# EAGLE design lcd_buckler_mk_1 (EAGLE 6.5.0)
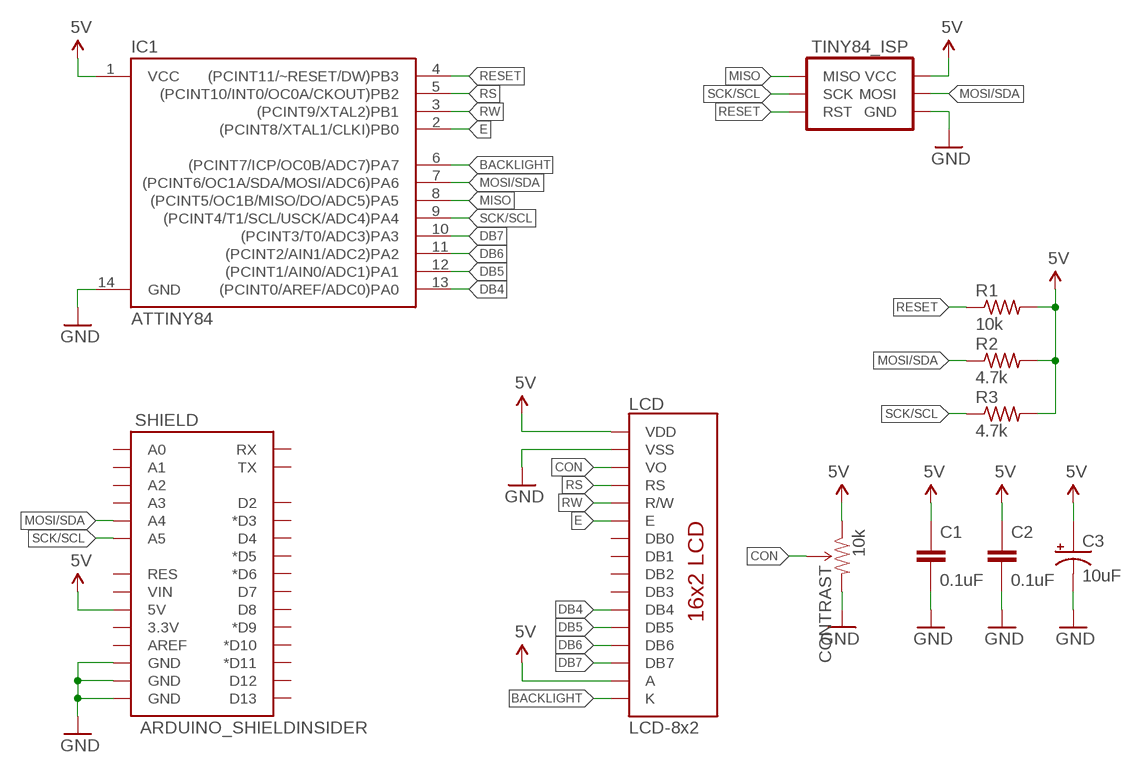
[diagram p0: schematic, sheet 1]

## Parts
C1  0.1uF  CAPACITOR-CERAMIC025-024X044  [C025-024X044]
C2  0.1uF  CAPACITOR-CERAMIC025-024X044  [C025-024X044]
C3  10uF  CAPACITOR-POLARIZEDE2.5-5  [E2,5-5]
CONTRAST  10k  TRIMPOTPTH  [TRIM_POT_PTH]
IC1  ATTINY84  ATTINY84ATTINY84-20PU  [DIL14]
LCD  LCD-8x2  LCD-16X28X2  [LCD-8X2]
R1  10k  RESISTORPTH-AXIAL-7.68MM  [RESISTOR-AXIAL-PTH-7.68MM]
R2  4.7k  RESISTORPTH-AXIAL-7.68MM  [RESISTOR-AXIAL-PTH-7.68MM]
R3  4.7k  RESISTORPTH-AXIAL-7.68MM  [RESISTOR-AXIAL-PTH-7.68MM]
SHIELD  ARDUINO_SHIELDINSIDER  [ARDUINO_SHIELD_NOOUTLINE_INSIDE]
TINY84_ISP  AVR_SPI_PRG_6PTH  [2X3]

## Nets
5V: C1.1 C2.1 C3.+ CONTRAST.1(CCW) IC1.1(VCC) LCD.2(VDD) LCD.15(A) R1.P$2 R2.P$2 R3.P$2 SHIELD.5V TINY84_ISP.2(VCC)
BACKLIGHT: IC1.6((PCINT7/ICP/OC0B/ADC7)PA7) LCD.16(K)
CON: CONTRAST.2(WIPER) LCD.3(VO)
DB4: IC1.13((PCINT0/AREF/ADC0)PA0) LCD.11(DB4)
DB5: IC1.12((PCINT1/AIN0/ADC1)PA1) LCD.12(DB5)
DB6: IC1.11((PCINT2/AIN1/ADC2)PA2) LCD.13(DB6)
DB7: IC1.10((PCINT3/T0/ADC3)PA3) LCD.14(DB7)
E: IC1.2((PCINT8/XTAL1/CLKI)PB0) LCD.6(E)
GND: C1.2 C2.2 C3.- CONTRAST.3(CW) IC1.14(GND) LCD.1(VSS) SHIELD.GND@0(GND) SHIELD.GND@1(GND) SHIELD.GND@2(GND) TINY84_ISP.6(GND)
MISO: IC1.8((PCINT5/OC1B/MISO/DO/ADC5)PA5) TINY84_ISP.1(MISO)
MOSI/SDA: IC1.7((PCINT6/OC1A/SDA/MOSI/ADC6)PA6) R2.P$1 SHIELD.A4 TINY84_ISP.4(MOSI)
RESET: IC1.4((PCINT11/~RESET/DW)PB3) R1.P$1 TINY84_ISP.5(RST)
RS: IC1.5((PCINT10/INT0/OC0A/CKOUT)PB2) LCD.4(RS)
RW: IC1.3((PCINT9/XTAL2)PB1) LCD.5(R/W)
SCK/SCL: IC1.9((PCINT4/T1/SCL/USCK/ADC4)PA4) R3.P$1 SHIELD.A5 TINY84_ISP.3(SCK)
Unconnected: LCD.7(DB0) LCD.8(DB1) LCD.9(DB2) LCD.10(DB3) SHIELD.3.3V SHIELD.A0 SHIELD.A1 SHIELD.A2 SHIELD.A3 SHIELD.AREF SHIELD.D2 SHIELD.D3(*D3) SHIELD.D4 SHIELD.D5(*D5) SHIELD.D6(*D6) SHIELD.D7 SHIELD.D8 SHIELD.D9(*D9) SHIELD.D10(*D10) SHIELD.D11(*D11) SHIELD.D12 SHIELD.D13 SHIELD.RES SHIELD.RX SHIELD.TX SHIELD.VIN

## Library data of the parts
C1 C2 = A_butts:CAPACITOR-CERAMIC: CAPACITOR, European symbol
C3 = A_butts:CAPACITOR-POLARIZED: POLARIZED CAPACITOR, American symbol
CONTRAST = A_butts:TRIMPOT: Various small potentiometers for "set-and-forget" applications
IC1 = A_butts:ATTINY84: Atmel 14-pin 2/4/8kB flash uC
LCD = A_butts:LCD-16X2: Standard text-only 16x2 parallel input LCD
R1-R3 = A_butts:RESISTOR: RESISTOR, American symbol
SHIELD = A_butts:ARDUINO_SHIELD: Arduino shield footprint
TINY84_ISP = A_butts:AVR_SPI_PRG_6: AVR ISP 6 Pin This is the reduced ISP connector for AVR programming. Common on Arduino. This footprint will take up less PCB space and can be used with a 10-pin to 6-pin adapter such as SKU: BOB-08508 **Special note about "TEST_POINT" package. The stop mask is on the top side, so if you want your programming test points to be on the bottom of your board, make sure to place this package on the bottom side of the board. This also ensure that the orientation to program from the bottom side will be correct.

## Board
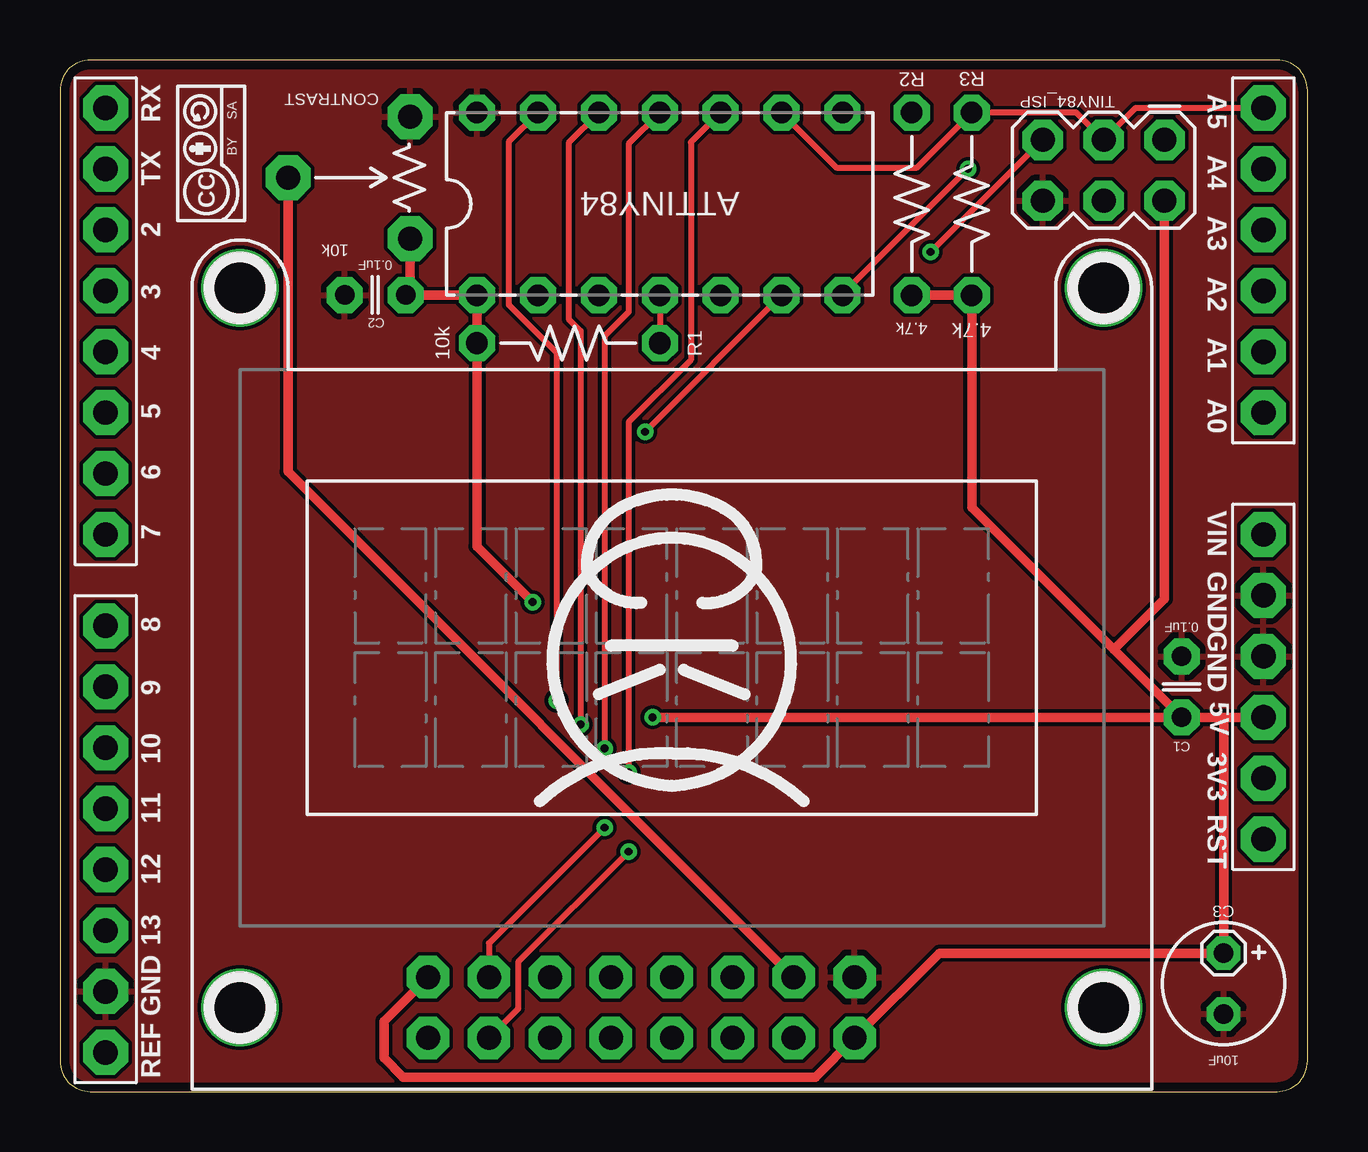
[diagram p1: board, top side]
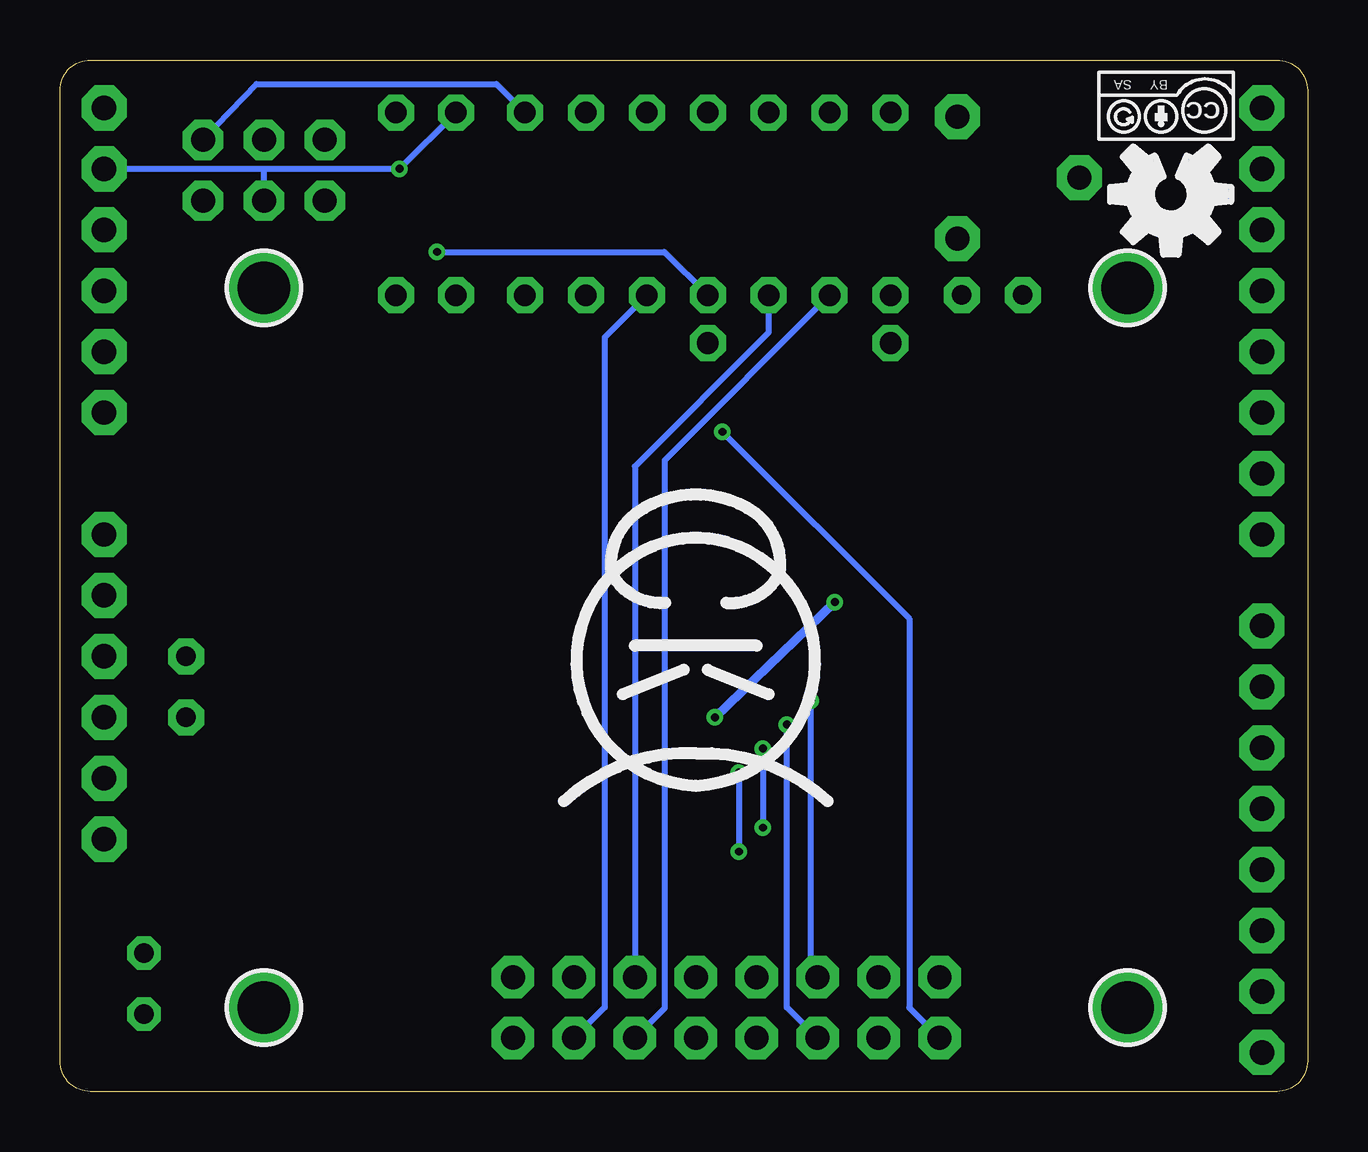
[diagram p2: board, bottom side, seen from below]

Size 52 x 43 mm. Coordinates in mm from the lower left corner, seen from the top.
Outline: 0,41.73 0,1.27 arc90 1.27,0 50.73,0 arc90 52,1.27 52,41.73 arc90 50.73,43 1.27,43 arc90 0,41.73
Copper layers (1*16): Top 0.0356mm / dielectric 1.5011mm / Bottom 0.0356mm
Design rules "LaenPCBOrder_2": minimum track width 6mil, minimum drill 13mil, track to track 6mil, track to pad 6mil, pad to pad 6mil, via to via 6mil, smd to smd 6mil, copper to edge 15mil, drill to drill 6mil, minimum pad ring 7mil, minimum via ring 7mil, stop-mask expansion 3mil, vias tented up to drill 20mil, thermal gap 10mil

### Footprints (pad centres in the part's own frame; a part is rotated, then mirrored left to right if it is on the bottom)
C025-024X044 = drill 0.813 pad 1.5 octagon: 1 -1.27,0; 2 1.27,0
E2,5-5 = drill 0.8 pad 1.4 octagon: + -1.27,0; - 1.27,0
TRIM_POT_PTH = drill 1 pad 1.88 octagon: 1 -2.54,-2.54; 2 0,2.54; 3 2.54,-2.54
DIL14 = drill 0.9 pad 1.5 octagon: 1 -7.62,-3.81; 2 -5.08,-3.81; 3 -2.54,-3.81; 4 0,-3.81; 5 2.54,-3.81; 6 5.08,-3.81; 7 7.62,-3.81; 8 7.62,3.81; 9 5.08,3.81; 10 2.54,3.81; 11 0,3.81; 12 -2.54,3.81; 13 -5.08,3.81; 14 -7.62,3.81
LCD-8X2 = drill 1 pad 1.778 octagon: 1 -7.62,13.73; 2 -7.62,16.27; 3 -5.08,13.73; 4 -5.08,16.27; 5 -2.54,13.73; 6 -2.54,16.27; 7 0,13.73; 8 0,16.27; 9 2.54,13.73; 10 2.54,16.27; 11 5.08,13.73; 12 5.08,16.27; 13 7.62,13.73; 14 7.62,16.27; 15 10.16,13.73; 16 10.16,16.27 | drill 2.2 pad 3: P$1 -18,-15; P$2 -18,15; P$3 18,15; P$4 18,-15
RESISTOR-AXIAL-PTH-7.68MM = drill 0.9 pad 1.5 octagon: P$1 -3.81,0; P$2 3.81,0
ARDUINO_SHIELD_NOOUTLINE_INSIDE = drill 1.016 pad 1.88 octagon: 3.3V 48.26,-27.94; 5V 48.26,-25.4; A0 48.26,-12.7; A1 48.26,-10.16; A2 48.26,-7.62; A3 48.26,-5.08; A4 48.26,-2.54; A5 48.26,0; AREF 0,-39.37; D2 0,-5.08; D3 0,-7.62; D4 0,-10.16; D5 0,-12.7; D6 0,-15.24; D7 0,-17.78; D8 0,-21.59; D9 0,-24.13; D10 0,-26.67; D11 0,-29.21; D12 0,-31.75; D13 0,-34.29; GND@0 48.26,-22.86; GND@1 48.26,-20.32; GND@2 0,-36.83; RES 48.26,-30.48; RX 0,0; TX 0,-2.54; VIN 48.26,-17.78
2X3 = drill 1 pad 1.676 octagon: 1 -2.54,-1.27; 2 -2.54,1.27; 3 0,-1.27; 4 0,1.27; 5 2.54,-1.27; 6 2.54,1.27

### Placement (x,y rotation side)
C1  46.75,16.87 90 top
C2  13.14,33.2 180 top
C3  48.5,4.5 270 top
CONTRAST  12.05,38.1 90 top
IC1  25,37 0 top
LCD  25.5,18.5 180 top
R1  21.19,31.2 180 top
R2  35.5,37 270 top
R3  38,37 270 top
SHIELD  1.9,41 0 top
TINY84_ISP  43.5,38.4 180 top
U$1  [COW]  25.5,19.1 180 bottom
U$2  [COW]  25.5,19.1 180 top
U$3  [CC-BY-SA-4.0-NO-URL]  6.3,39.1 90 top
U$4  [CC-BY-SA-4.0-NO-URL]  5.9,41.1 180 bottom
U$6  [OSHWLOGO_BOT_0.2]  5.7,37.4 180 top

### Tracks (layer width: path | path; a pad name or v marks a point on that pad's centre or on a via)
5V  (via drill 0.33)
  Top 0.4: C1.1 48.5,15.6 | 48.5,15.6 SHIELD.5V | C1.1 43.92,18.43 | 43.92,18.43 38,24.35 R3.P$2 R2.P$2 | TINY84_ISP.2 46.04,20.54 43.92,18.43 | 48.5,15.6 C3.+ 36.66,5.77 LCD.2 31.49,0.6 14.3,0.6 13.5,1.4 13.5,2.93 LCD.15 | v24.7,15.6 C1.1 | v19.7,20.4 17.38,22.72 R1.P$2 IC1.1 C2.1 14.59,33.2 CONTRAST.1
  Bottom 0.4: v19.7,20.4 v24.7,15.6
BACKLIGHT  (via drill 0.33)
  Top 0.25: IC1.6 v24.39,27.5
  Bottom 0.25: LCD.16 16.6,3.49 16.6,19.71 v24.39,27.5
CON
  Top 0.4: CONTRAST.2 9.51,25.84 LCD.3
DB4  (via drill 0.33)
  Top 0.25: IC1.13 18.7,39.59 18.7,32.8 20.7,30.8 v20.7,16.3
  Bottom 0.25: LCD.11 20.7,5.05 v20.7,16.3
DB5  (via drill 0.33)
  Top 0.25: IC1.12 21.2,39.55 21.2,32.2 21.7,31.7 v21.7,15.3
  Bottom 0.25: LCD.12 21.7,3.51 v21.7,15.3
DB6  (via drill 0.33)
  Top 0.25: IC1.11 23.7,39.51 23.7,32.5 22.7,31.5 v22.7,14.3 | v22.7,11 17.88,6.18 LCD.13
  Bottom 0.25: v22.7,14.3 v22.7,11
DB7  (via drill 0.33)
  Top 0.25: IC1.10 26.3,39.57 26.3,30.5 23.7,27.9 v23.7,13.3 | LCD.14 19.1,3.45 19.1,5.4 v23.7,10
  Bottom 0.25: v23.7,13.3 v23.7,10
E
  Bottom 0.25: LCD.6 26.8,3.47 26.8,26.31 IC1.2
GND
  pour Top: 50.73,0 1.27,0 arc-90 0,1.27 0,41.73 arc-90 1.27,43 50.73,43 arc-90 52,41.73 52,1.27 arc-90
MISO
  Bottom 0.25: TINY84_ISP.1 43.81,42 33.81,42 IC1.8
MOSI/SDA  (via drill 0.33)
  Top 0.25: v37.85,38.46 32.62,33.23 IC1.7
  Bottom 0.25: SHIELD.A4 43.5,38.46 | 43.5,38.46 v37.85,38.46 R2.P$1 | TINY84_ISP.4 43.5,38.46
RESET  (via drill 0.33)
  Top 0.25: IC1.4 R1.P$1 | TINY84_ISP.5 v36.29,35
  Bottom 0.25: IC1.4 26.81,35 v36.29,35
RS
  Bottom 0.25: LCD.4 29.3,3.51 29.3,31.43 IC1.5
RW
  Bottom 0.25: IC1.3 22.46,31.64 28.04,26.06 LCD.5
SCK/SCL
  Top 0.25: SHIELD.A5 44.83,41 TINY84_ISP.3 42.36,40.81 R3.P$1 35.69,38.5 32.39,38.5 IC1.9